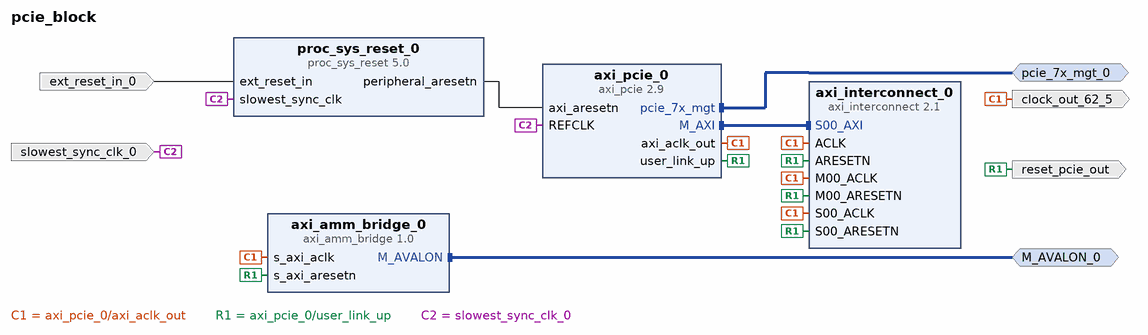
[diagram p0: block diagram of the top level]
# Vivado block design pcie_block, xc7a50tcsg325-2L, Vivado 2023.2
create_bd_design pcie_block

create_bd_intf_port -mode Master -vlnv xilinx.com:interface:pcie_7x_mgt_rtl:1.0 pcie_7x_mgt_0
create_bd_intf_port -mode Master -vlnv xilinx.com:interface:avalon_rtl:1.0 M_AVALON_0
create_bd_port -dir I -type clk slowest_sync_clk_0
create_bd_port -dir I -type rst ext_reset_in_0
create_bd_port -dir O -type clk clock_out_62_5
create_bd_port -dir O -type rst reset_pcie_out

create_bd_cell -type ip -vlnv xilinx.com:ip:axi_pcie:2.9 axi_pcie_0
set_property -dict {CONFIG.BAR0_SCALE Megabytes CONFIG.BAR0_SIZE 1} [get_bd_cells axi_pcie_0]
create_bd_cell -type ip -vlnv xilinx.com:ip:proc_sys_reset:5.0 proc_sys_reset_0
create_bd_cell -type ip -vlnv xilinx.com:ip:axi_interconnect:2.1 axi_interconnect_0
set_property -dict {CONFIG.NUM_MI 1} [get_bd_cells axi_interconnect_0]
create_bd_cell -type ip -vlnv xilinx.com:ip:axi_amm_bridge:1.0 axi_amm_bridge_0
set_property -dict [list \
  CONFIG.C_AVM_BURST_WIDTH 1 \
  CONFIG.C_BEGIN_BURST_TRANSFER 1 \
  CONFIG.C_HAS_RESPONSE 0 \
  CONFIG.C_PROTOCOL 1 \
  CONFIG.C_S_AXI_DATA_WIDTH 64 \
  CONFIG.C_USE_BYTEENABLE 0 \
] [get_bd_cells axi_amm_bridge_0]

# ---- connections ----

connect_bd_intf_net [get_bd_intf_ports M_AVALON_0] [get_bd_intf_pins axi_amm_bridge_0/M_AVALON]
connect_bd_intf_net [get_bd_intf_pins axi_pcie_0/M_AXI] [get_bd_intf_pins axi_interconnect_0/S00_AXI]
connect_bd_intf_net [get_bd_intf_ports pcie_7x_mgt_0] [get_bd_intf_pins axi_pcie_0/pcie_7x_mgt]
connect_bd_net [get_bd_pins axi_pcie_0/axi_aclk_out] \
  [get_bd_pins axi_interconnect_0/ACLK] [get_bd_pins axi_interconnect_0/S00_ACLK] [get_bd_pins axi_interconnect_0/M00_ACLK] \
  [get_bd_pins axi_amm_bridge_0/s_axi_aclk] [get_bd_ports clock_out_62_5]
connect_bd_net [get_bd_pins axi_pcie_0/user_link_up] \
  [get_bd_pins axi_interconnect_0/ARESETN] [get_bd_pins axi_interconnect_0/S00_ARESETN] \
  [get_bd_pins axi_interconnect_0/M00_ARESETN] [get_bd_pins axi_amm_bridge_0/s_axi_aresetn] [get_bd_ports reset_pcie_out]
connect_bd_net -net ext_reset_in_0_1 [get_bd_ports ext_reset_in_0] [get_bd_pins proc_sys_reset_0/ext_reset_in]
connect_bd_net [get_bd_pins proc_sys_reset_0/peripheral_aresetn] [get_bd_pins axi_pcie_0/axi_aresetn]
connect_bd_net -net slowest_sync_clk_0_1 [get_bd_ports slowest_sync_clk_0] \
  [get_bd_pins proc_sys_reset_0/slowest_sync_clk] [get_bd_pins axi_pcie_0/REFCLK]

validate_bd_design
save_bd_design
